# Altium project Diplomski Rad.PrjPcb
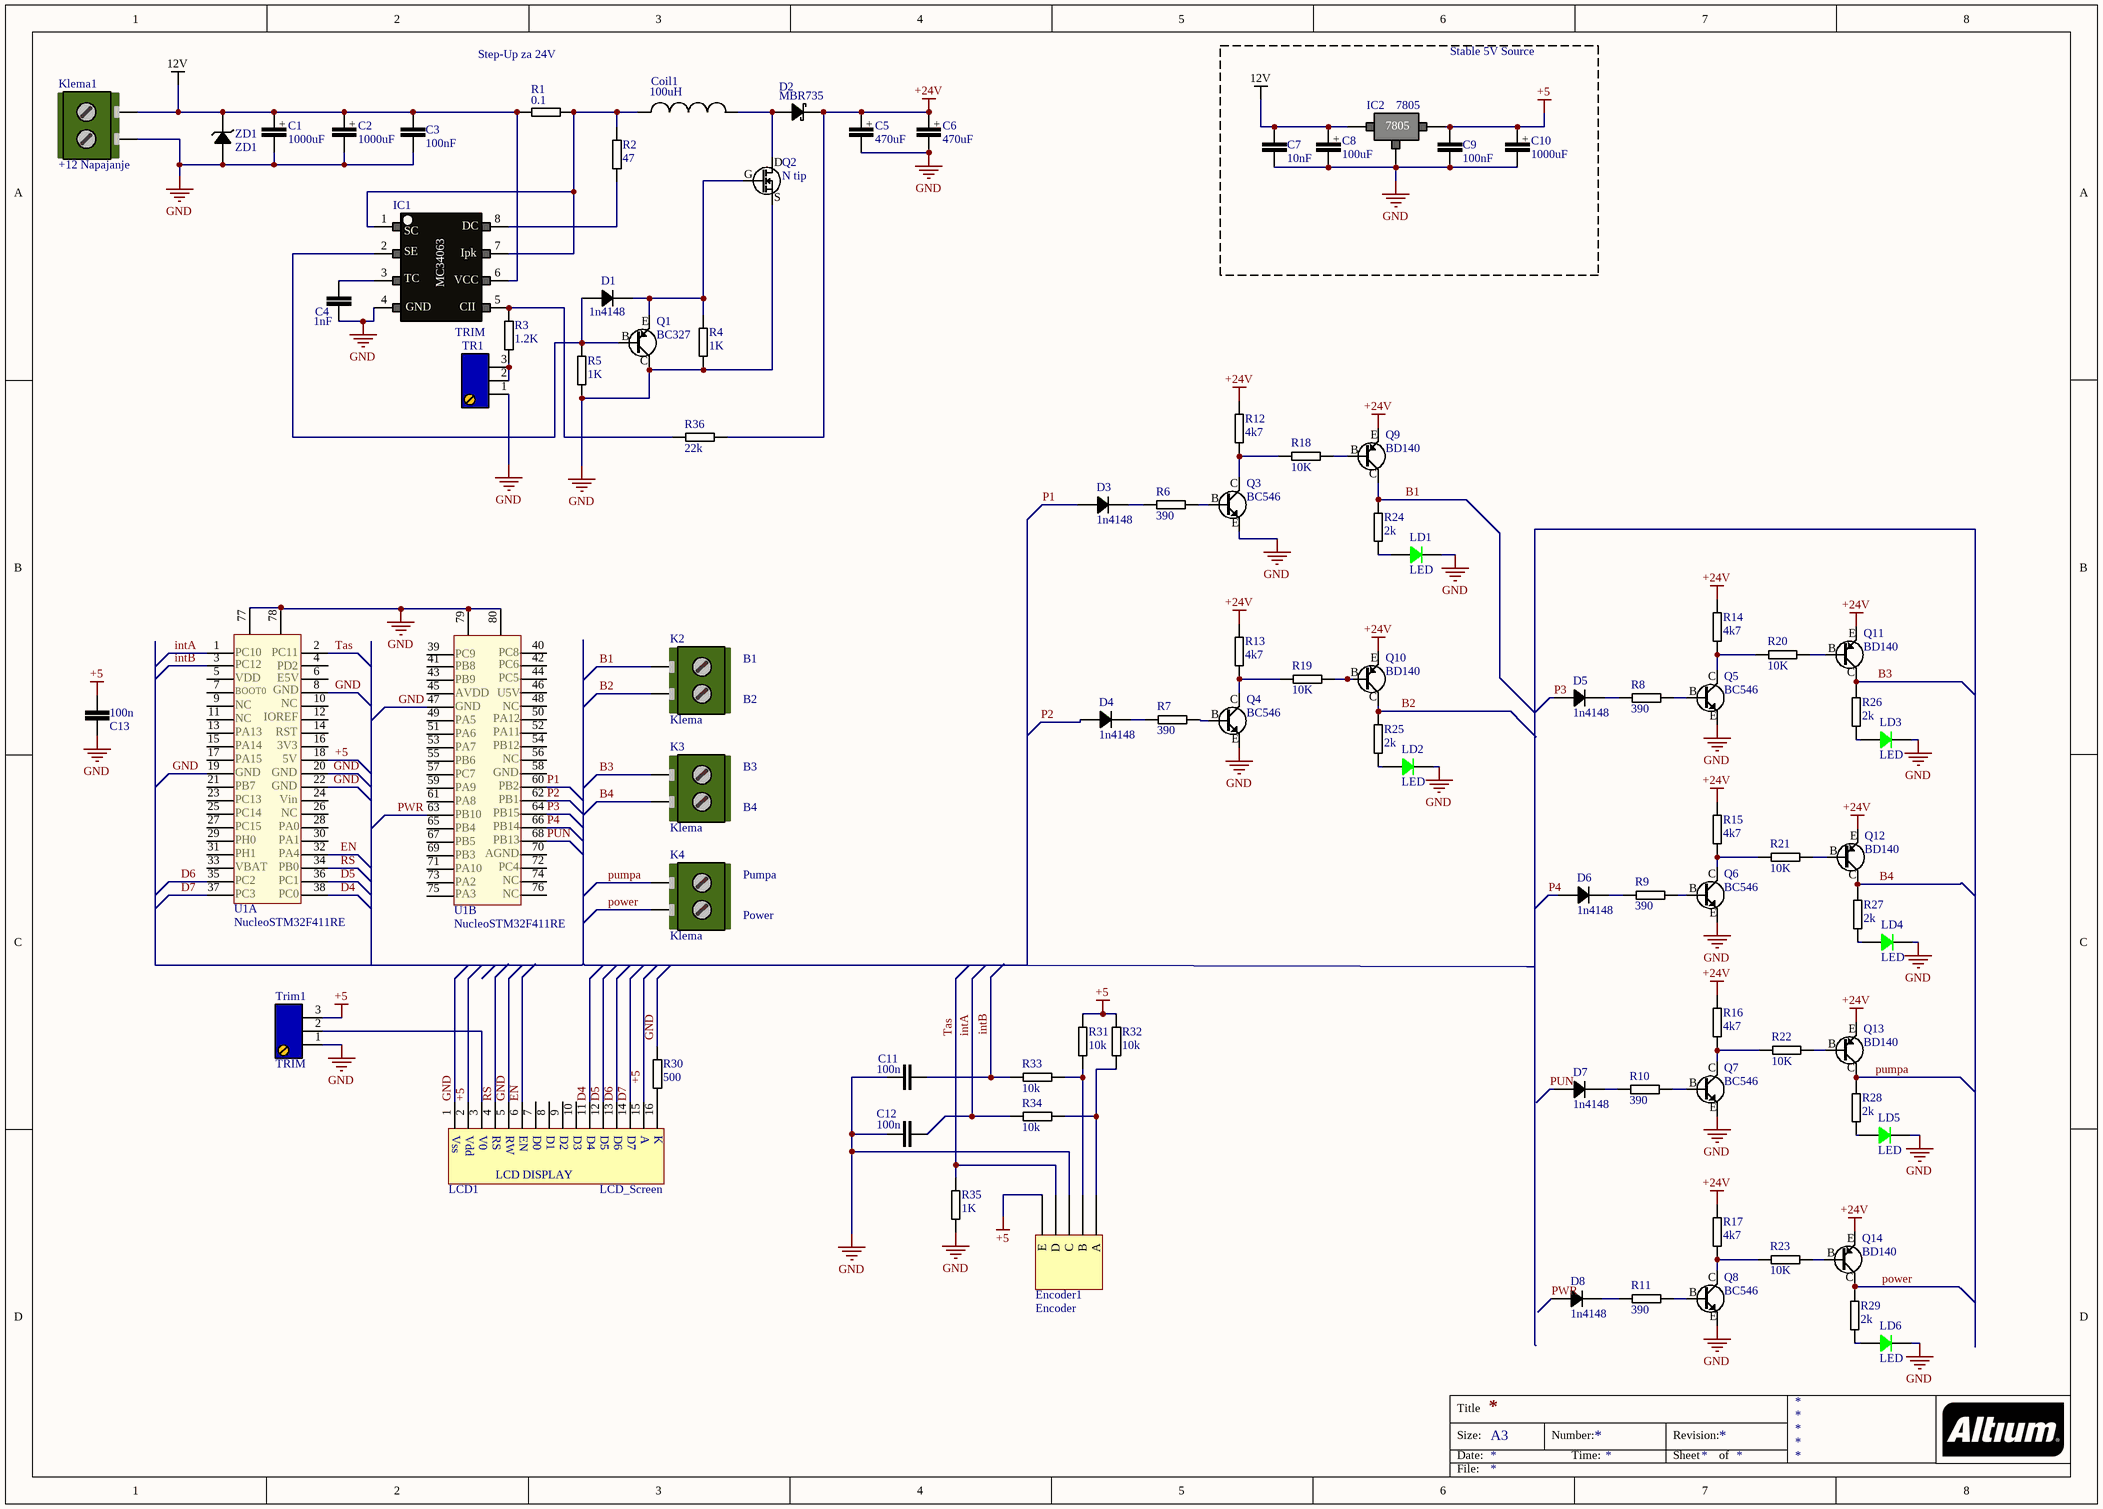
[diagram p0: DiplomskiRad.SchDoc]
1 sheet, 90 parts. Net scope: global (net labels, ports and power ports of the same name join across sheets).
Board file: DiplomskiRad.PcbDoc

## Sheet DiplomskiRad.SchDoc
size A3

### Parts
100n  C13  [C1(ceramic)]
C1  1000uF  [C2(elektrolit)]
C2  1000uF  [C2(elektrolit)]
C3  100nF  [C1(ceramic)]
C4  1nF  [C1(ceramic)]
C5  470uF  [C2(elektrolit)]
C6  470uF  [C2(elektrolit)]
C7  10nF  [C1(ceramic)]
C8  100uF  [C2(elektrolit)]
C9  100nF  [C1(ceramic)]
C10  1000uF  [C2(elektrolit)]
C11  100n  [C1(ceramic)]
C12  100n  [C1(ceramic)]
Coil1  100uH  [Coil_14x8]
D1  1n4148  [D1(300milsa)]
D2  MBR735  [D2(TO220)]
D3  1n4148  [D1(300milsa)]
D4  1n4148  [D1(300milsa)]
D5  1n4148  [D1(300milsa)]
D6  1n4148  [D1(300milsa)]
D7  1n4148  [D1(300milsa)]
D8  1n4148  [D1(300milsa)]
Encoder1  Encoder  [Encoder]
IC1  (no value)  [DIP8]
IC2  7805  [TO220]
K2  Klema  [Klema]
K3  Klema  [Klema]
K4  Klema  [Klema]
Klema1  +12 Napajanje  [Klema]
LCD1  LCD_Screen  [LCD_Screen]
LD1  LED  [LED(3mm)]
LD2  LED  [LED(3mm)]
LD3  LED  [LED(3mm)]
LD4  LED  [LED(3mm)]
LD5  LED  [LED(3mm)]
LD6  LED  [LED(3mm)]
Q1  BC327  [TO-92]
Q2  N tip  [N-Channel MOSFET]
Q3  BC546  [TO-92]
Q4  BC546  [TO-92]
Q5  BC546  [TO-92]
Q6  BC546  [TO-92]
Q7  BC546  [TO-92]
Q8  BC546  [TO-92]
Q9  BD140  [TO126]
Q10  BD140  [TO126]
Q11  BD140  [TO126]
Q12  BD140  [TO126]
Q13  BD140  [TO126]
Q14  BD140  [TO126]
R1  0.1  [R1(2W)]
R2  47  [R1(300milsa)]
R3  1.2K  [R1(300milsa)]
R4  1K  [R1(300milsa)]
R5  1K  [R1(300milsa)]
R6  390  [R1(300milsa)]
R7  390  [R1(300milsa)]
R8  390  [R1(300milsa)]
R9  390  [R1(300milsa)]
R10  390  [R1(300milsa)]
R11  390  [R1(300milsa)]
R12  4k7  [R1(300milsa)]
R13  4k7  [R1(300milsa)]
R14  4k7  [R1(300milsa)]
R15  4k7  [R1(300milsa)]
R16  4k7  [R1(300milsa)]
R17  4k7  [R1(300milsa)]
R18  10K  [R1(300milsa)]
R19  10K  [R1(300milsa)]
R20  10K  [R1(300milsa)]
R21  10K  [R1(300milsa)]
R22  10K  [R1(300milsa)]
R23  10K  [R1(300milsa)]
R24  2k  [R1(300milsa)]
R25  2k  [R1(300milsa)]
R26  2k  [R1(300milsa)]
R27  2k  [R1(300milsa)]
R28  2k  [R1(300milsa)]
R29  2k  [R1(300milsa)]
R30  500  [R1(300milsa)]
R31  10k  [R1(300milsa)]
R32  10k  [R1(300milsa)]
R33  10k  [R1(300milsa)]
R34  10k  [R1(300milsa)]
R35  1K  [R1(300milsa)]
R36  22k  [R1(300milsa)]
TR1  TRIM  [TRIM]
Trim1  TRIM  [TRIM]
U1  NucleoSTM32F411RE  [Nucleo411]  (parts A,B of 2)
ZD1  ZD1  [D1(300milsa)]

### Blocks framed on the sheet
Stable 5V Source: C7-C10 IC2

### Nets
12V: C1.1 C2.1 C3.2 C7.1 C8.1 IC1.6 IC2.1 Klema1.2 R1.1 ZD1.2
+5: 100n.2 C9.1 C10.1 Encoder1.5(E) IC2.3 LCD1.2 LCD1.15 R31.2 R32.2 Trim1.3 U1.18
+24V: C5.1 C6.1 D2.2 Q9.1 Q10.1 Q11.1 Q12.1 Q13.1 Q14.1 R12.2 R13.2 R14.2 R15.2 R16.2 R17.2 R36.2
GND: 100n.1 C1.2 C2.2 C3.1 C4.1 C5.2 C6.2 C7.2 C8.2 C9.2 C10.2 C11.1 C12.2 Encoder1.3(C) IC1.4 IC2.2 Klema1.1 LCD1.1 LCD1.5 LD1.2 LD2.2 LD3.2 LD4.2 LD5.2 LD6.2 Q1.3 Q2.3 Q3.2 Q4.2 Q5.2 Q6.2 Q7.2 Q8.2 R4.1 R5.1 R30.2 R35.2 TR1.1 Trim1.1 U1.8 U1.19 U1.20 U1.22 U1.47 U1.77 U1.78 U1.79 U1.80 ZD1.1
B1: K2.1 Q9.2 R24.1
B2: K2.2 Q10.2 R25.1
B3: K3.1 Q11.2 R26.1
B4: K3.2 Q12.2 R27.1
D4: LCD1.11 U1.38
D5: LCD1.12 U1.36
D6: LCD1.13 U1.35
D7: LCD1.14 U1.37
EN: LCD1.6 U1.32
intA: C12.1 R34.2 U1.1
intB: C11.2 R33.2 U1.3
P1: D3.1 U1.60
P2: D4.1 U1.62
P3: D5.1 U1.64
P4: D6.1 U1.66
power: K4.2 Q14.2 R29.1
pumpa: K4.1 Q13.2 R28.1
PUN: D7.1 U1.68
PWR: D8.1 U1.63
RS: LCD1.4 U1.34
Tas: Encoder1.4(D) R35.1 U1.2
NetC4_2: C4.2 IC1.3
NetCoil1_1: Coil1.1 IC1.1 IC1.7 R1.2 R2.2
NetCoil1_2: Coil1.2 D2.1 Q2.2
NetD1_1: D1.1 IC1.2 Q1.1 R5.2
NetD1_2: D1.2 Q1.2 Q2.1 R4.2
NetD3_2: D3.2 R6.1
NetD4_2: D4.2 R7.1
NetD5_2: D5.2 R8.1
NetD6_2: D6.2 R9.1
NetD7_2: D7.2 R10.1
NetD8_2: D8.2 R11.1
NetEncoder1_1: Encoder1.1(A) R32.1 R34.1
NetEncoder1_2: Encoder1.2(B) R31.1 R33.1
NetIC1_5: IC1.5 R3.2 R36.1
NetIC1_8: IC1.8 R2.1
NetLCD1_3: LCD1.3 Trim1.2
NetLCD1_16: LCD1.16 R30.1
NetLD1_1: LD1.1 R24.2
NetLD2_1: LD2.1 R25.2
NetLD3_1: LD3.1 R26.2
NetLD4_1: LD4.1 R27.2
NetLD5_1: LD5.1 R28.2
NetLD6_1: LD6.1 R29.2
NetQ3_1: Q3.1 R6.2
NetQ3_3: Q3.3 R12.1 R18.1
NetQ4_1: Q4.1 R7.2
NetQ4_3: Q4.3 R13.1 R19.1
NetQ5_1: Q5.1 R8.2
NetQ5_3: Q5.3 R14.1 R20.1
NetQ6_1: Q6.1 R9.2
NetQ6_3: Q6.3 R15.1 R21.1
NetQ7_1: Q7.1 R10.2
NetQ7_3: Q7.3 R16.1 R22.1
NetQ8_1: Q8.1 R11.2
NetQ8_3: Q8.3 R17.1 R23.1
NetQ9_3: Q9.3 R18.2
NetQ10_3: Q10.3 R19.2
NetQ11_3: Q11.3 R20.2
NetQ12_3: Q12.3 R21.2
NetQ13_3: Q13.3 R22.2
NetQ14_3: Q14.3 R23.2
NetR3_1: R3.1 TR1.2 TR1.3

Not connected (* = marked no-connect by the designer): LCD1 7 8 9 10; U1 4(3) 5(3) 6(4) 7(4) 9(5) 10(6) 11(6) 12(7) 13(7) 14(8) 15(8) 16(9) 17(9) 21(11) 23(12) 24(13) 25(13) 26(14) 27(14) 28(15) 29(15) 30(16) 31(16) 33(17) 39 40 41(40) 42(41) 43(41) 44(42) 45(42) 46(43) 48(44) 49(44) 50(45) 51(45) 52(46) 53(46) 54(47) 55(47) 56(48) 57(48) 58(49) 59(49) 61(50) 65(52) 67(53) 69(54) 70(55) 71(55) 72(56) 73(56) 74(57) 75(57) 76(58)

### Notes on the sheet
- (near R1) Step-Up za 24V
- B1
- B2
- B3
- B4
- Pumpa
- Power
- Title
- Size:
- Date:
- A3
- Number:
- Time:
- Revision:
- Sheet
- of
- File:
- (in symbol BD140) E; B; C
- (in symbol C2) +
- (in symbol LCD_Screen) Vss; Vdd; V0; RS; RW; EN; D0; D1; D2; D3; D4; D5; D6; D7; A; K; LCD DISPLAY
- (in symbol MC34063) DC; SC; SE; Ipk; TC; VCC; GND; CII
- (in symbol N-Channel MOSFET) D; G; S
- (in symbol NucleoSTM32F411RE, part A) PC10; PC11; PC12; PD2; VDD; E5V; BOOT0; GND; NC; IOREF; PA13; RST; PA14; 3V3; PA15; 5V; PB7; PC13; Vin; PC14; PC15; PA0; PH0; PA1; PH1; PA4; VBAT; PB0; PC2; PC1; PC3; PC0
- (in symbol NucleoSTM32F411RE, part B) PC9; PC8; PB8; PC6; PB9; PC5; AVDD; U5V; GND; NC; PA5; PA12; PA6; PA11; PA7; PB12; PB6; PC7; PA9; PB2; PA8; PB1; PB10; PB15; PB4; PB14; PB5; PB13; PB3; AGND; PA10; PC4; PA2; PA3
- (in symbol Transistor NPN) C; B; E
- (in symbol Transistor PNP) E; B; C

### Library data of the parts
100n C3 C4 C7 C9 C11 C12 = C1
C1 C2 C5 C6 C8 C10 = C2
Coil1 = Coil
D1 D3-D8 = D1
D2 = Sotki Diode
IC1 = MC34063
Klema1 = Klema
Q1 = Transistor PNP
Q2 = N-Channel MOSFET
Q3-Q8 = Transistor NPN
R1-R36 = R1